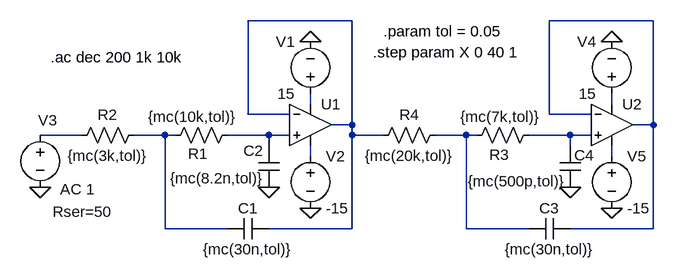
[diagram p0: schematic 3.5Khz_opamp_filter.asc]
3.5Khz_opamp_filter.asc, the LTspice schematic file:
Version 4
SHEET 1 920 680
WIRE 272 0 112 0
WIRE 736 0 576 0
WIRE 208 128 208 112
WIRE 672 128 672 112
WIRE 112 144 112 0
WIRE 176 144 112 144
WIRE 576 144 576 0
WIRE 640 144 576 144
WIRE 272 160 272 0
WIRE 272 160 240 160
WIRE 736 160 736 0
WIRE 736 160 704 160
WIRE -144 176 -208 176
WIRE -16 176 -64 176
WIRE 0 176 -16 176
WIRE 144 176 80 176
WIRE 176 176 144 176
WIRE 272 176 272 160
WIRE 320 176 272 176
WIRE 448 176 400 176
WIRE 464 176 448 176
WIRE 608 176 544 176
WIRE 640 176 608 176
WIRE 144 192 144 176
WIRE 608 192 608 176
WIRE 208 208 208 192
WIRE 672 208 672 192
WIRE -16 320 -16 176
WIRE 80 320 -16 320
WIRE 272 320 272 176
WIRE 272 320 144 320
WIRE 448 320 448 176
WIRE 544 320 448 320
WIRE 736 320 736 160
WIRE 736 320 608 320
FLAG 208 32 0
FLAG 208 288 0
FLAG 144 256 0
FLAG -208 256 0
FLAG 672 32 0
FLAG 672 288 0
FLAG 608 256 0
SYMBOL OpAmps\\UniversalOpAmp1 208 160 R0
SYMATTR InstName U1
SYMBOL voltage 208 128 R180
WINDOW 0 24 96 Left 2
WINDOW 3 24 16 Left 2
WINDOW 123 0 0 Left 0
WINDOW 39 0 0 Left 0
SYMATTR InstName V1
SYMATTR Value 15
SYMBOL voltage 208 192 R0
WINDOW 123 0 0 Left 0
WINDOW 39 0 0 Left 0
SYMATTR InstName V2
SYMATTR Value -15
SYMBOL cap 80 304 M90
WINDOW 0 0 32 VBottom 2
WINDOW 3 32 32 VTop 2
SYMATTR InstName C1
SYMATTR Value {mc(30n,tol)}
SYMBOL cap 160 192 M0
WINDOW 3 23 50 Left 2
SYMATTR Value {mc(8.2n,tol)}
SYMATTR InstName C2
SYMBOL res 96 160 R90
WINDOW 0 60 61 VBottom 2
WINDOW 3 -28 70 VTop 2
SYMATTR InstName R1
SYMATTR Value {mc(10k,tol)}
SYMBOL res -48 160 R90
WINDOW 0 0 56 VBottom 2
WINDOW 3 32 56 VTop 2
SYMATTR InstName R2
SYMATTR Value {mc(3k,tol)}
SYMBOL voltage -208 160 R0
WINDOW 0 -3 -7 Left 2
WINDOW 123 31 99 Left 2
WINDOW 39 19 134 Left 2
SYMATTR InstName V3
SYMATTR Value2 AC 1
SYMATTR SpiceLine Rser=50
SYMATTR Value ""
SYMBOL OpAmps\\UniversalOpAmp1 672 160 R0
SYMATTR InstName U2
SYMBOL voltage 672 128 R180
WINDOW 0 24 96 Left 2
WINDOW 3 24 16 Left 2
WINDOW 123 0 0 Left 0
WINDOW 39 0 0 Left 0
SYMATTR InstName V4
SYMATTR Value 15
SYMBOL voltage 672 192 R0
WINDOW 123 0 0 Left 0
WINDOW 39 0 0 Left 0
SYMATTR InstName V5
SYMATTR Value -15
SYMBOL cap 608 304 R90
WINDOW 0 0 32 VBottom 2
WINDOW 3 32 32 VTop 2
SYMATTR InstName C3
SYMATTR Value {mc(30n,tol)}
SYMBOL cap 624 192 M0
WINDOW 3 22 55 Left 2
WINDOW 0 -21 15 Left 2
SYMATTR Value {mc(500p,tol)}
SYMATTR InstName C4
SYMBOL res 560 160 R90
WINDOW 0 62 61 VBottom 2
WINDOW 3 -28 60 VTop 2
SYMATTR InstName R3
SYMATTR Value {mc(7k,tol)}
SYMBOL res 416 160 R90
WINDOW 0 0 56 VBottom 2
WINDOW 3 32 56 VTop 2
SYMATTR InstName R4
SYMATTR Value {mc(20k,tol)}
TEXT -192 56 Left 2 !.ac dec 200 1k 10k
TEXT 320 16 Left 2 !.param tol = 0.05
TEXT 304 48 Left 2 !.step param X 0 40 1

The netlist it stands for:
* 3.5Khz_opamp_filter.asc
XU1 N007 N001 N003 N010 N001 level1 Avol=1Meg GBW=10Meg Vos=0 En=0 Enk=0 In=0 Ink=0 Rin=500Meg  ; pins In+ In- V+ V- OUT
V1 N003 0 15
V2 N010 0 -15
C1 N006 N001 {mc(30n,tol)}
C2 N007 0 {mc(8.2n,tol)}
R1 N007 N006 {mc(10k,tol)}
R2 N006 N005 {mc(3k,tol)}
V3 N005 0 AC 1 Rser=50
XU2 N009 N002 N004 N011 N002 level1 Avol=1Meg GBW=10Meg Vos=0 En=0 Enk=0 In=0 Ink=0 Rin=500Meg  ; pins In+ In- V+ V- OUT
V4 N004 0 15
V5 N011 0 -15
C3 N002 N008 {mc(30n,tol)}
C4 N009 0 {mc(500p,tol)}
R3 N009 N008 {mc(7k,tol)}
R4 N008 N001 {mc(20k,tol)}
.ac dec 200 1k 10k
.param tol = 0.05
.step param X 0 40 1
.lib UniversalOpAmp1.lib
.backanno
.end